# EAGLE design flash-interface (EAGLE 9.5.0)
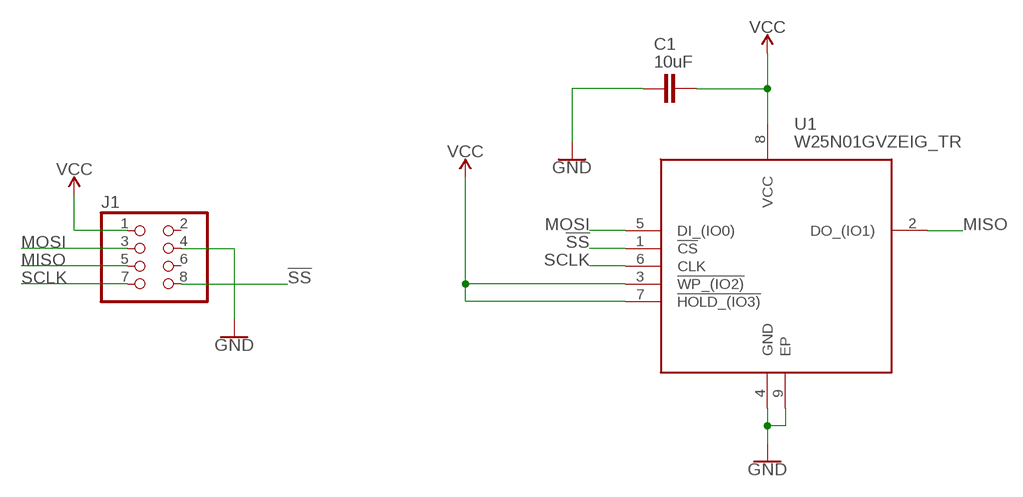
[diagram p0: schematic, sheet 1]

## Parts
C1  10uF  10UF-0805-10V-10%  [0805]
J1  PINHD-2X4  [2X04]
U1  W25N01GVZEIG_TR  [SON127P800X600X80-9N]

## Nets
!SS: J1.8 U1.1(!CS)
GND: C1.2 J1.4 U1.4(GND) U1.9(EP)
MISO: J1.5 U1.2(DO_(IO1))
MOSI: J1.3 U1.5(DI_(IO0))
SCLK: J1.7 U1.6(CLK)
VCC: C1.1 J1.1 U1.3(!WP_(IO2)) U1.7(!HOLD_(IO3)) U1.8(VCC)
Unconnected: J1.2 J1.6

## Library data of the parts
C1 = SparkFun-Capacitors:10UF: 10.0µF ceramic capacitors A capacitor is a passive two-terminal electrical component used to store electrical energy temporarily in an electric field.; PROD_ID: CAP-11330
J1 = pinhead:PINHD-2X4: PIN HEADER
U1 = flash-interface:W25N01GVZEIG_TR: IC FLASH 1GBIT 104MHZ 8WSON Source: Datasheet <https://componentsearchengine.com/Datasheets/1/W25N01GVZEIG TR.pdf>; DESCRIPTION: IC FLASH 1GBIT 104MHZ 8WSON; HEIGHT: 0.8mm; MANUFACTURER_NAME: Winbond; MANUFACTURER_PART_NUMBER: W25N01GVZEIG TR; MOUSER_PART_NUMBER: 454-W25N01GVZEIGTR; MOUSER_PRICE-STOCK: https://www.mouser.com/Search/Refine.aspx?Keyword=454-W25N01GVZEIGTR

## Board
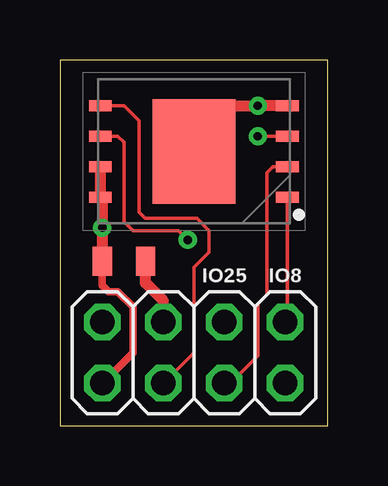
[diagram p1: board, top side]
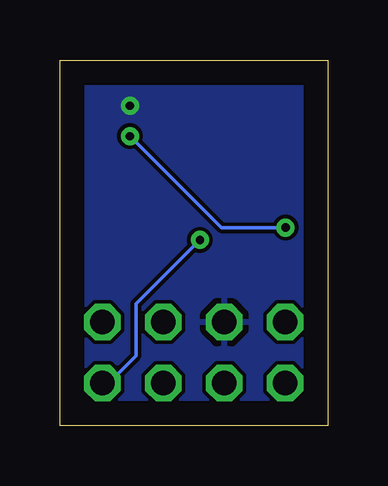
[diagram p2: board, bottom side, seen from below]

Size 11.18 x 15.24 mm. Coordinates in mm from the lower left corner, seen from the top.
Outline: 0,0 11.18,0 11.18,15.24 0,15.24 0,0
Copper layers (1*16): Top 0.035mm / dielectric 1.5mm / Bottom 0.035mm
Design rules "default": minimum track width 6mil, minimum drill 0.35mm, track to track 6mil, track to pad 6mil, pad to pad 6mil, via to via 6mil, smd to smd 6mil, copper to edge 40mil, drill to drill 6mil, minimum pad ring 10mil, minimum via ring 8mil, stop-mask expansion 4mil, vias tented up to drill 0mil, thermal gap 10mil

### Footprints (pad centres in the part's own frame; a part is rotated, then mirrored left to right if it is on the bottom)
0805 = smd 0.8 x 1.2: 1 -0.9,0; 2 0.9,0
2X04 = drill 1.016 octagon: 1 -3.81,-1.27; 2 -3.81,1.27; 3 -1.27,-1.27; 4 -1.27,1.27; 5 1.27,-1.27; 6 1.27,1.27; 7 3.81,-1.27; 8 3.81,1.27
SON127P800X600X80-9N = smd 0.95 x 0.45: 1 -3.9,1.905; 2 -3.9,0.635; 3 -3.9,-0.635; 4 -3.9,-1.905; 5 3.9,-1.905; 6 3.9,-0.635; 7 3.9,0.635; 8 3.9,1.905 | smd 3.45 x 4.35: 9 0,0

### Placement (x,y rotation side)
C1  2.67,6.86 0 top
J1  5.59,3.05 0 top
U1  5.59,11.43 180 top

### Tracks (layer width: path | path; a pad name or v marks a point on that pad's centre or on a via)
!SS
  Top 0.152: U1.1 9.49,4.41 J1.8
GND  (via drill 0.35)
  Top 0.457: U1.9 6.48,12.32 6.48,13.21 6.6,13.34 v8.26,13.34 U1.4 | J1.4 4.32,5.21 3.57,5.96 C1.2
  pour Bottom (isolate 0.001): 0,15.24 11.18,15.24 11.18,0 0,0
MISO
  Top 0.152: U1.2 8.89,10.79 8.64,10.54 8.64,5.46 8.26,5.08 8.26,2.92 7.11,1.78 J1.5
MOSI
  Top 0.152: U1.5 2.67,13.34 3.3,12.7 3.3,8.89 3.56,8.64 5.71,8.64 6.22,8.13 6.22,7.24 5.59,6.6 5.59,3.05 J1.3
SCLK  (via drill 0.35)
  Top 0.152: U1.6 2.41,12.06 2.67,11.81 2.67,8.51 3.05,8.13 4.95,8.13 v5.33,7.75
  Bottom 0.152: J1.7 9.14,1.78 8,2.92 8,5.08 v5.33,7.75
VCC  (via drill 0.35)
  Top 0.152: U1.3 v8.26,12.06
  Top 0.305: J1.1 3.05,3.05 3.05,4.95 2.41,5.59 2.03,5.59 1.77,5.85 C1.1
  Top 0.457: C1.1 v1.77,8.26 1.77,9.45 U1.8 U1.7
  Bottom 0.152: v8.26,12.06 4.45,8.26 v1.77,8.26

### Text on the board
tNames: IO25 | IO8